# EAGLE design ratt (EAGLE 5.01)
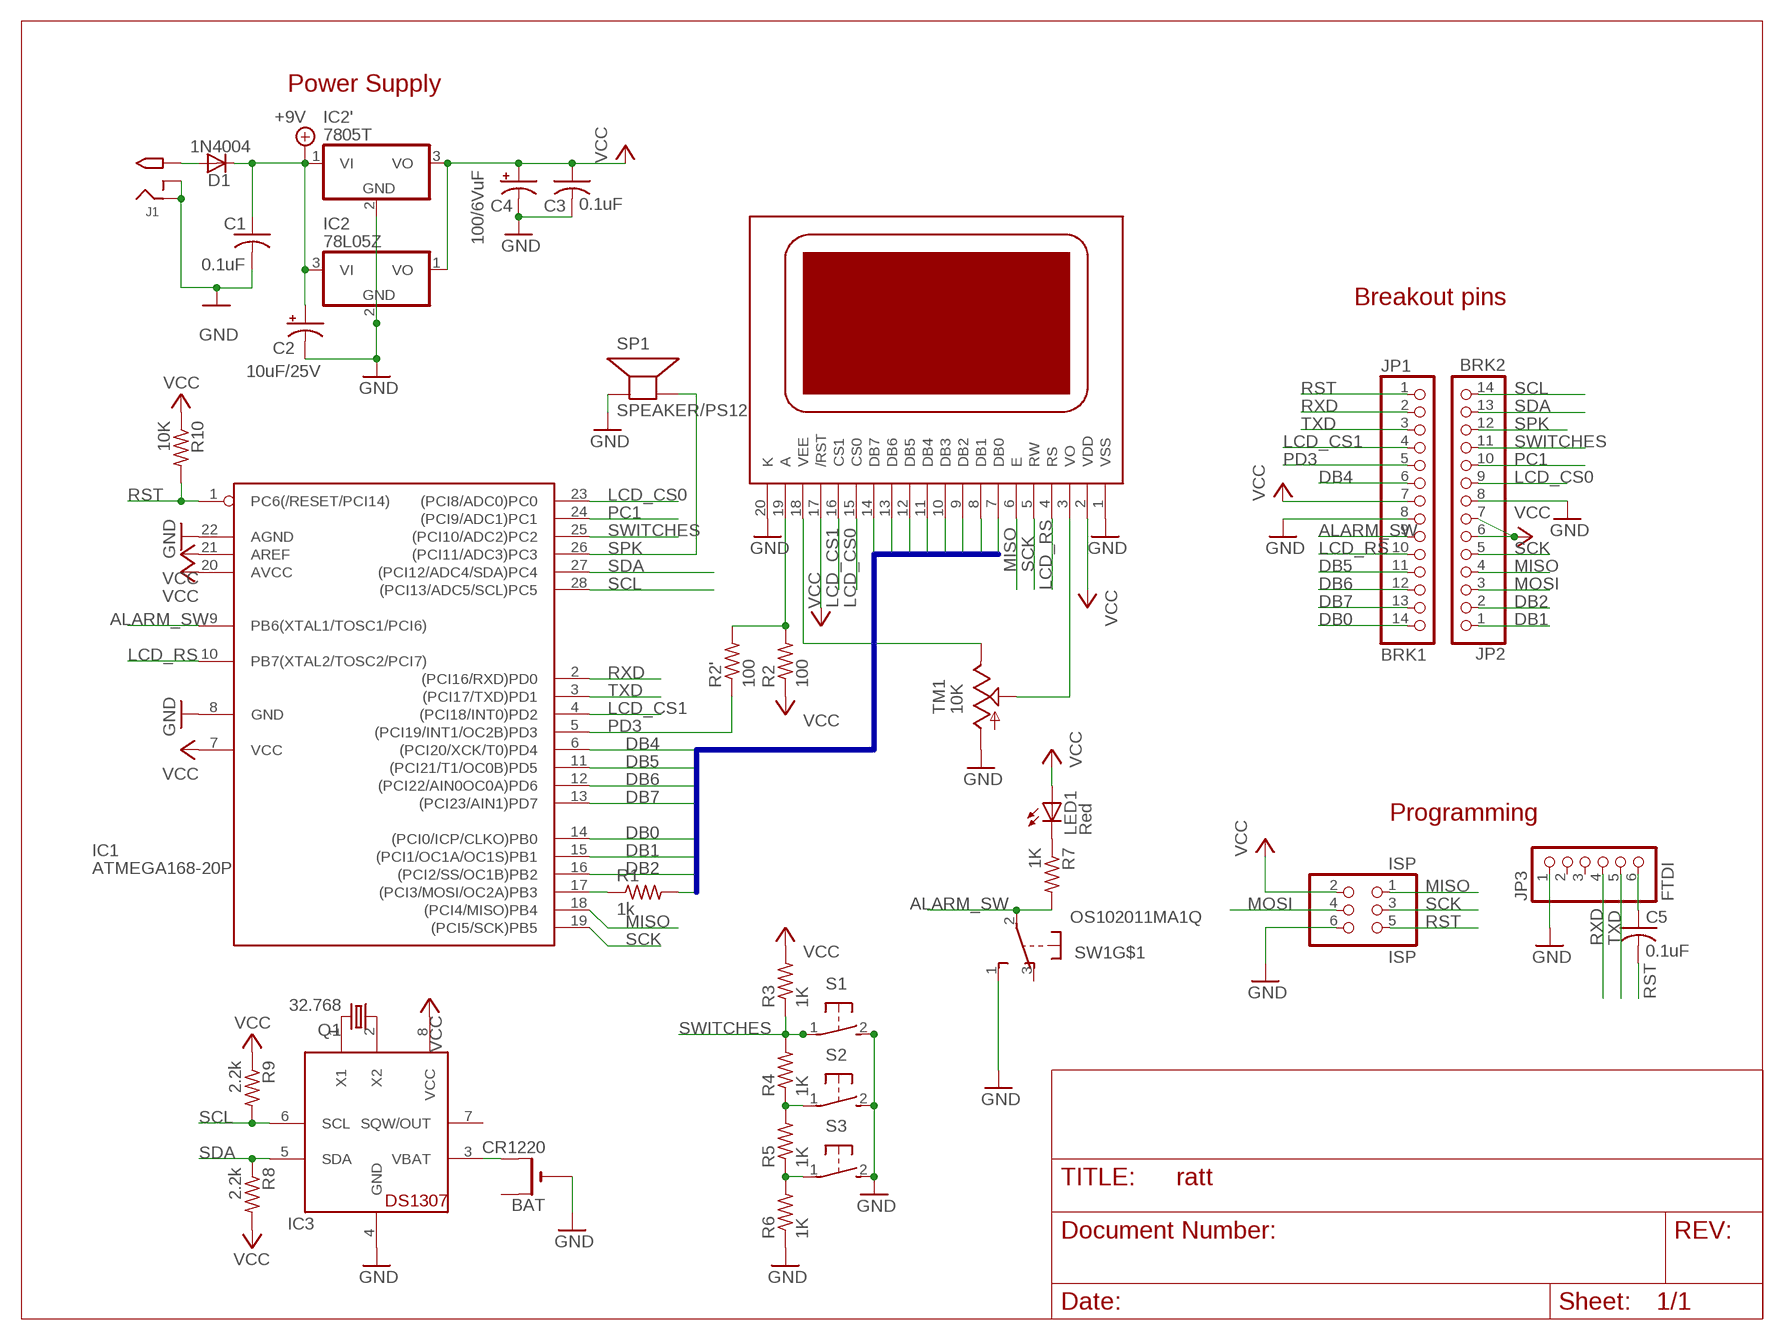
[diagram p0: schematic, sheet 1]

## Parts
BAT  CR1220  CR1220THM  [CR1220-THM]
C1  0.1uF  C-US025-025X050  [C025-025X050]
C2  10uF/25V  CPOL-USE2,5-6E  [E2,5-6E]
C3  0.1uF  C-US025-025X050  [C025-025X050]
C4  100/6VuF  CPOL-USE2,5-6E  [E2,5-6E]
C5  0.1uF  C-US025-025X050  [C025-025X050]
D1  1N4004  [DO41-10]
IC1  ATMEGA168-20P  [DIL28-3]
IC2  78L05Z  [TO92]
IC2'  7805T  [TO220H]
IC3  DS1307  [DIL08]
ISP  ISP  PINHD-2X3  [2X03]
J1  2.1MMJACK  [PJ-102A]
JP1  BRK1  PINHD-1X14  [1X14]
JP2  BRK2  PINHD-1X14  [1X14]
JP3  FTDI  PINHD-1X6  [1X06]
LED1  Red  LED3MM  [LED3MM]
Q1  32.768  CRYTALTC38H  [TC38H]
R1  1k  R-US_0207/10  [0207/10]
R2  100  R-US_0207/10  [0207/10]
R2'  100  R-US_0207/10  [0207/10]
R3  1K  R-US_0207/10  [0207/10]
R4  1K  R-US_0207/10  [0207/10]
R5  1K  R-US_0207/10  [0207/10]
R6  1K  R-US_0207/10  [0207/10]
R7  1K  R-US_0207/10  [0207/10]
R8  2.2k  R-US_0207/10  [0207/10]
R9  2.2k  R-US_0207/10  [0207/10]
R10  10K  R-US_0207/10  [0207/10]
S1  31-XX  [B3F-31XX]
S2  31-XX  [B3F-31XX]
S3  31-XX  [B3F-31XX]
SP1  SPEAKER/PS12  [PS12]
SW1  OS102011MA1Q  [OS102011MA1Q]
TM1  10K  TRIM_US-CA6H  [CA6H]
U$1  TS12864A  [TS12864]

## Nets
+9V: C1.1 C2.+ D1.C IC2'.1(VI) IC2.3(VI)
A: R2'.2 R2.2 U$1.19(A)
ALARM_SW: IC1.9(PB6(XTAL1/TOSC1/PCI6)) JP1.9 R7.2 SW1.2(P)
DB0: IC1.14((PCI0/ICP/CLKO)PB0) JP1.14 U$1.7(DB0)
DB1: IC1.15((PCI1/OC1A/OC1S)PB1) JP2.1 U$1.8(DB1)
DB2: IC1.16((PCI2/SS/OC1B)PB2) JP2.2 U$1.9(DB2)
DB3: R1.2 U$1.10(DB3)
DB4: IC1.6((PCI20/XCK/T0)PD4) JP1.6 U$1.11(DB4)
DB5: IC1.11((PCI21/T1/OC0B)PD5) JP1.11 U$1.12(DB5)
DB6: IC1.12((PCI22/AIN0OC0A)PD6) JP1.12 U$1.13(DB6)
DB7: IC1.13((PCI23/AIN1)PD7) JP1.13 U$1.14(DB7)
GND: BAT.- C1.2 C2.- C3.2 C4.- IC1.8(GND) IC1.22(AGND) IC2'.2(GND) IC2.2(GND) IC3.4(GND) ISP.6 J1.RING J1.RING_SW JP1.8 JP2.8 JP3.1 R6.1 S1.2(S) S2.2(S) S3.2(S) SP1.P$1(+) SW1.1(S) TM1.A U$1.1(VSS) U$1.20(K)
LCD_CS0: IC1.23((PCI8/ADC0)PC0) JP2.9 U$1.15(CS0)
LCD_CS1: IC1.4((PCI18/INT0)PD2) JP1.4 U$1.16(CS1)
LCD_RS: IC1.10(PB7(XTAL2/TOSC2/PCI7)) JP1.10 U$1.4(RS)
MISO: IC1.18((PCI4/MISO)PB4) ISP.1 JP2.4 U$1.6(E)
MOSI: IC1.17((PCI3/MOSI/OC2A)PB3) ISP.4 JP2.3 R1.1
N$3: R4.1 R5.2 S2.1(P)
N$4: TM1.S U$1.3(VO)
N$14: IC3.1(X1) Q1.2
N$15: IC3.2(X2) Q1.1
N$17: D1.A J1.TIP
N$39: BAT.+2(+1) IC3.3(VBAT)
N$51: C5.1 JP3.6
N$148: LED1.K(C) R7.1
N$149: R5.1 R6.2 S3.1(P)
PC1: IC1.24((PCI9/ADC1)PC1) JP2.10
PD3: IC1.5((PCI19/INT1/OC2B)PD3) JP1.5 R2'.1
RST: C5.2 IC1.1(PC6(/RESET/PCI14)) ISP.5 JP1.1 R10.2
RXD: IC1.2((PCI16/RXD)PD0) JP1.2 JP3.4
SCK: IC1.19((PCI5/SCK)PB5) ISP.3 JP2.5 U$1.5(RW)
SCL: IC1.28((PCI13/ADC5/SCL)PC5) IC3.6(SCL) JP2.14 R9.2
SDA: IC1.27((PCI12/ADC4/SDA)PC4) IC3.5(SDA) JP2.13 R8.1
SPK: IC1.26((PCI11/ADC3)PC3) JP2.12 SP1.P$2(-)
SWITCHES: IC1.25((PCI10/ADC2)PC2) JP2.11 R3.1 R4.2 S1.1(P)
TXD: IC1.3((PCI17/TXD)PD1) JP1.3 JP3.5
VCC: C3.1 C4.+ IC1.7(VCC) IC1.20(AVCC) IC1.21(AREF) IC2'.3(VO) IC2.1(VO) IC3.8(VCC) ISP.2 JP1.7 JP2.6 JP2.7 LED1.A R2.1 R3.2 R8.2 R9.1 R10.1 U$1.2(VDD) U$1.17(/RST)
VEE: TM1.E U$1.18(VEE)
Unconnected: BAT.+1(+) IC3.7(SQW/OUT) JP3.2 JP3.3 SW1.3(O) SW1.MT1(MT) SW1.MT2(MT)

## Buses
DB[0..7]

## Notes on the sheet
- Power Supply
- Breakout pins
- Programming

## Library data of the parts
BAT = adafruit:CR1220: CR1216/CR1220/CR1225 12mm 3V lithium coin cell Great for battery packup. Both SMT and THM holders. Note the THM package has the ground pads on both sides of the PCB so that the masks are the same - this reduces the cost
C1 C3 C5 = adafruit:C-US: CAPACITOR, American symbol
C2 C4 = adafruit:CPOL-US: POLARIZED CAPACITOR, American symbol
D1 = adafruit:1N4004: DIODE General purpose 1N400x type rectifier (With bigger pads) http://www.ladyada.net/library/pcb/eaglelibrary.html
IC1 = avr:ATMEGA168*P: MICROCONTROLLER 16 kBytes FLASH 1 kBytes SRAM 512 Bytes EEPROM USART 8-channel 10 bit ADC
IC2 = linear-ez:78*: Positive VOLTAGE REGULATOR Source: http://cache.national.com/ds/LM/LM78L05.pdf http://www.fairchildsemi.com/ds/LM/LM7805.pdf
IC2' = linear:78*: Positive VOLTAGE REGULATOR Source: http://cache.national.com/ds/LM/LM78L05.pdf http://www.fairchildsemi.com/ds/LM/LM7805.pdf
IC3 = adafruit:DS1307: DS1307 Real time clock (RTC) with battery backup ability. Talk to it via i2c
ISP = pinhead-ez:PINHD-2X3: PIN HEADER
J1 = adafruit:2.1MMJACK: 2.1mm x 5.5mm DC jack with internal switch. Digikey part #PJ-102A, 4UCON part #05537 By microbuilder.eu
JP1 JP2 = pinhead:PINHD-1X14: PIN HEADER
JP3 = pinhead:PINHD-1X6: PIN HEADER
LED1 = adafruit:LED: LED OSRAM: - CHIPLED LG R971, LG N971, LY N971, LG Q971, LY Q971, LO R971, LY R971 LH N974, LH R974 LS Q976, LO Q976, LY Q976 LO Q996 - Hyper CHIPLED LW Q18S LB Q993, LB Q99A, LB R99A - SideLED LS A670, LO A670, LY A670, LG A670, LP A670 LB A673, LV A673, LT A673, LW A673 LH A674 LY A675 LS A676, LA A676, LO A676, LY A676, LW A676 LS A679, LY A679, LG A679 - Hyper Micro SIDELED® LS Y876, LA Y876, LO Y876, LY Y876 LT Y87S - SmartLED LW L88C, LW L88S LB L89C, LB L89S, LG L890 LS L89K, LO L89K, LY L89K LS L896, LA L896, LO L896, LY L896 - TOPLED LS T670, LO T670, LY T670, LG T670, LP T670 LSG T670, LSP T670, LSY T670, LOP T670, LYG T670 LG T671, LOG T671, LSG T671 LB T673, LV T673, LT T673, LW T673 LH T674 LS T676, LA T676, LO T676, LY T676, LB T676, LH T676, LSB T676, LW T676 LB T67C, LV T67C, LT T67C, LS T67K, LO T67K, LY T67K, LW E67C LS E67B, LA E67B, LO E67B, LY E67B, LB E67C, LV E67C, LT E67C LW T67C LS T679, LY T679, LG T679 LS T770, LO T770, LY T770, LG T770, LP T770 LB T773, LV T773, LT T773, LW T773 LH T774 LS E675, LA E675, LY E675, LS T675 LS T776, LA T776, LO T776, LY T776, LB T776 LHGB T686 LT T68C, LB T68C - Hyper Mini TOPLED® LB M676 - Mini TOPLED Santana® LG M470 LS M47K, LO M47K, LY M47K Source: http://www.osram.convergy.de/
Q1 = crystal:CRYTAL: CRYSTAL
R1 R2 R2' R3-R10 = adafruit:R-US_: RESISTOR, American symbol
S1-S3 = adafruit:31-XX: OMRON SWITCH Now with beefier pads!
SP1 = adafruit:SPEAKER: SPEAKER Source: Buerklin Added PS12 (for part # PS1240 piezo) http://www.ladyada.net/library/pcb/eaglelibrary.html
SW1 = adafruit:OS102011MA1Q: OS10201MA1Q through-hole right angle switch http://www.ladyada.net/library/eagle
TM1 = pot:TRIM_US-: POTENTIOMETER
U$1 = adafruit:TS12864A: KS0108 based display. Some have slightly different pinouts so double check!

## Board
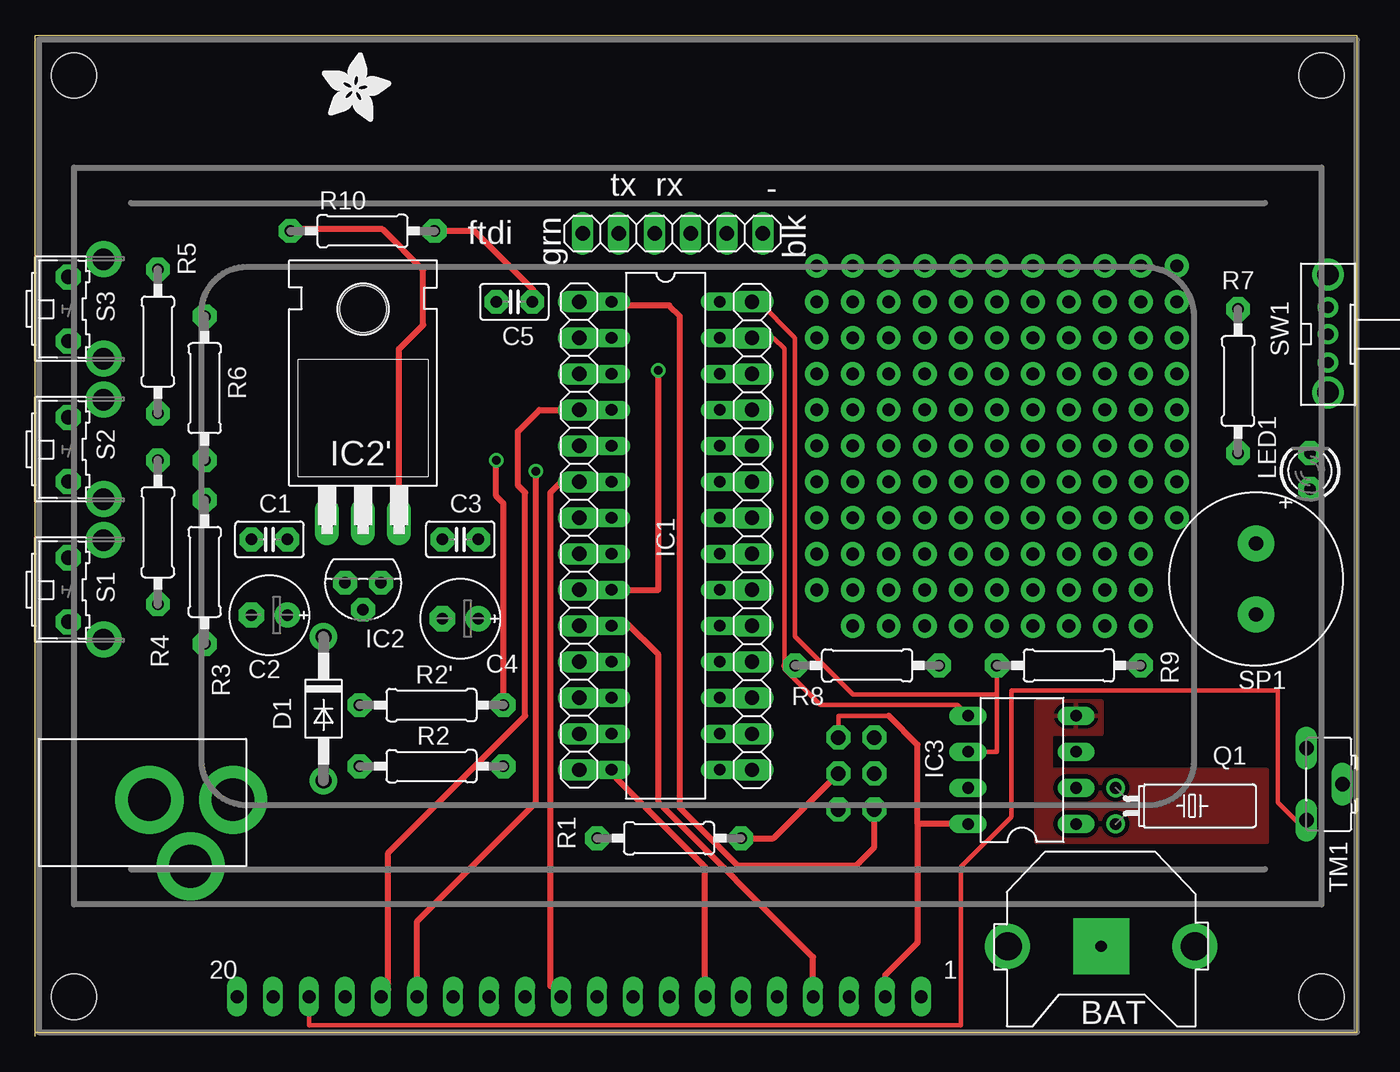
[diagram p1: board, top side]
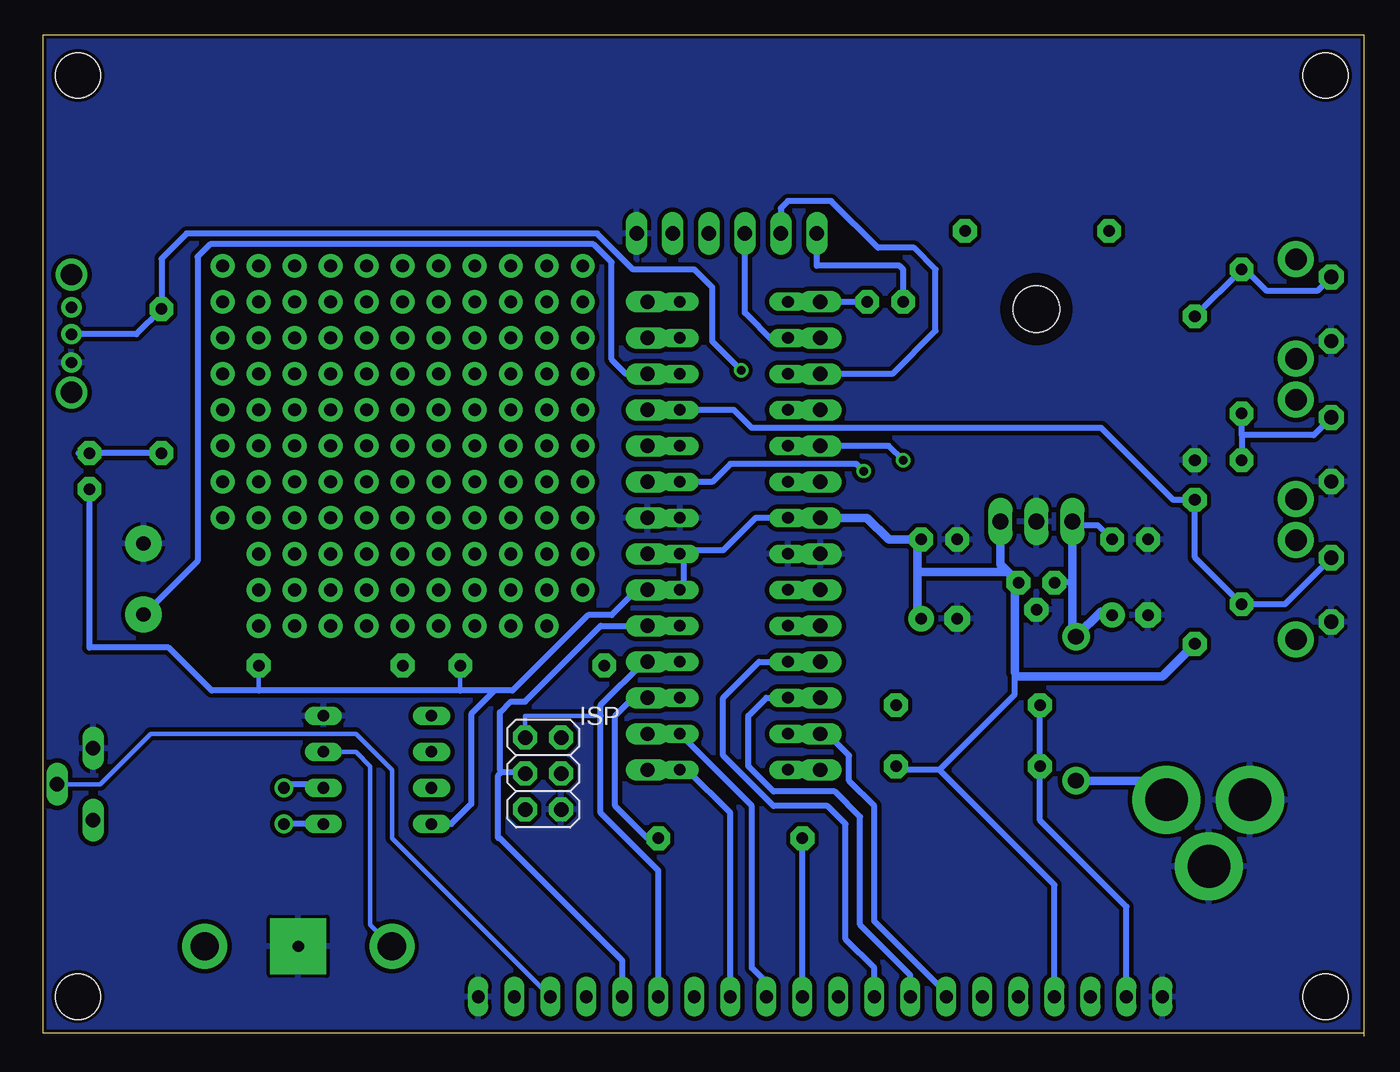
[diagram p2: board, bottom side, seen from below]

Size 93.22 x 70.61 mm. Coordinates in mm from the lower left corner, seen from the top.
Outline: 0,0 0,0.25
Outline: 0,0.25 0,70.61 93.22,70.61 93.22,0.25 0,0.25
Copper layers (1*16): Top 0.035mm / dielectric 1.5mm / Bottom 0.035mm
Design rules "default *": minimum track width 10mil, minimum drill 20mil, track to track 12mil, track to pad 12mil, pad to pad 12mil, via to via 12mil, smd to smd 0mil, copper to edge 10mil, drill to drill 8mil, minimum pad ring 10mil, minimum via ring 8mil, stop-mask expansion 4mil, vias tented up to drill 20mil, thermal gap 10mil

### Footprints (pad centres in the part's own frame; a part is rotated, then mirrored left to right if it is on the bottom)
CR1220-THM = drill 2 pad 3.175 round: +1 -6.604,0; +2 6.604,0 | drill 0.8 pad 3.962 square: - 0,0
C025-025X050 = drill 0.813 pad 1.676 octagon: 1 -1.27,0; 2 1.27,0
E2,5-6E = drill 0.813 pad 1.778 round: + -1.27,0 | drill 0.813 pad 1.778 octagon: - 1.27,0
DO41-10 = drill 1.118 pad 1.93 round: A 5.08,0; C -5.08,0
DIL28-3 = drill 0.813 long: 1 -16.51,-3.81; 2 -13.97,-3.81; 3 -11.43,-3.81; 4 -8.89,-3.81; 5 -6.35,-3.81; 6 -3.81,-3.81; 7 -1.27,-3.81; 8 1.27,-3.81; 9 3.81,-3.81; 10 6.35,-3.81; 11 8.89,-3.81; 12 11.43,-3.81; 13 13.97,-3.81; 14 16.51,-3.81; 15 16.51,3.81; 16 13.97,3.81; 17 11.43,3.81; 18 8.89,3.81; 19 6.35,3.81; 20 3.81,3.81; 21 1.27,3.81; 22 -1.27,3.81; 23 -3.81,3.81; 24 -6.35,3.81; 25 -8.89,3.81; 26 -11.43,3.81; 27 -13.97,3.81; 28 -16.51,3.81
TO92 = drill 0.813 pad 1.676 octagon: 1 -1.27,0; 2 0,1.905; 3 1.27,0
TO220H = drill 1.118 long: 1 -2.54,-10.16; 2 0,-10.16; 3 2.54,-10.16 | hole 3.302: 0,4.826
DIL08 = drill 0.813 long: 1 -3.81,-3.81; 2 -1.27,-3.81; 3 1.27,-3.81; 4 3.81,-3.81; 5 3.81,3.81; 6 1.27,3.81; 7 -1.27,3.81; 8 -3.81,3.81
2X03 = drill 1.016 pad 1.676 octagon: 1 -2.54,-1.27; 2 -2.54,1.27; 3 0,-1.27; 4 0,1.27; 5 2.54,-1.27; 6 2.54,1.27
PJ-102A = drill 3 pad 4.8 round: RING 0.1,-3.39; RING_SW -4.6,-6.29; TIP 0.1,-9.29
1X14 = drill 1.016 long: 1 -16.51,0; 2 -13.97,0; 3 -11.43,0; 4 -8.89,0; 5 -6.35,0; 6 -3.81,0; 7 -1.27,0; 8 1.27,0; 9 3.81,0; 10 6.35,0; 11 8.89,0; 12 11.43,0; 13 13.97,0; 14 16.51,0
1X06 = drill 1.016 long: 1 -6.35,0; 2 -3.81,0; 3 -1.27,0; 4 1.27,0; 5 3.81,0; 6 6.35,0
LED3MM = drill 0.813 pad 1.676 octagon: A -1.27,0; K 1.27,0
TC38H = drill 0.813 round: 1 -1.27,0; 2 1.27,0
0207/10 = drill 0.813 pad 1.676 octagon: 1 -5.08,0; 2 5.08,0
B3F-31XX = drill 1.016 pad 1.778 octagon: 1 -2.261,-1.245; 2 2.261,-1.245 | drill 1.499 pad 2.54 round: 3 -3.505,1.245; 4 3.505,1.245
PS12 = drill 1 pad 2.54 round: P$1 -2.5,0; P$2 2.5,0
OS102011MA1Q = drill 0.8 pad 1.422 round: 1 -2,0; 2 0,0; 3 1.9,0 | drill 1.5 pad 2.184 round: MT1 -4.1,0; MT2 4.2,0
CA6H = drill 1.016 long: A -2.54,0; E 2.54,0; S 0,2.54
TS12864 = drill 0.9 long: 1 48.26,0; 2 45.72,0; 3 43.18,0; 4 40.64,0; 5 38.1,0; 6 35.56,0; 7 33.02,0; 8 30.48,0; 9 27.94,0; 10 25.4,0; 11 22.86,0; 12 20.32,0; 13 17.78,0; 14 15.24,0; 15 12.7,0; 16 10.16,0; 17 7.62,0; 18 5.08,0; 19 2.54,0; 20 0,0 | hole 3.2: -11.5,65; 76.5,65; -11.5,0; 76.5,0

### Placement (x,y rotation side)
BAT  75.18,6.35 180 top
C1  16.51,35.05 180 top
C2  16.51,29.72 180 top
C3  29.97,35.05 180 top
C4  29.97,29.46 180 top
C5  33.78,51.82 0 top
D1  20.32,23.11 270 top
IC1  44.45,35.31 270 top
IC2  23.11,32 180 top
IC2'  23.11,46.48 0 top
IC3  69.6,18.8 90 top
ISP  57.91,18.54 270 bottom
J1  4.65,16.59 90 top
JP1  38.35,35.31 270 top
JP2  50.55,35.31 90 top
JP3  44.96,56.64 180 top
LED1  89.92,39.88 90 top
Q1  76.2,16.26 270 top
R1  44.7,13.97 180 top
R2  27.94,19.05 180 top
R2'  27.94,23.37 180 top
R3  11.94,32.77 270 top
R4  8.64,35.56 270 top
R5  8.64,49.02 270 top
R6  11.94,45.72 90 top
R7  84.84,46.23 90 top
R8  58.67,26.16 0 top
R9  72.9,26.16 180 top
R10  23.07,56.81 0 top
S1  3.56,31.5 270 top
S2  3.56,41.4 270 top
S3  3.56,51.31 270 top
SP1  86.11,32.26 270 top
SW1  91.19,49.53 90 top
TM1  89.66,17.78 270 top
U$1  14.22,2.79 0 top
U$2  [ADAFRUIT_5MM]  20.21,64.54 0 top

### Tracks (layer width: path | path; a pad name or v marks a point on that pad's centre or on a via)
+9V
  Bottom 0.406: 20.57,32 IC2.3 | IC2'.1 20.32,36.07 18.8,36.07 C1.1
  Bottom 0.61: 20.57,36.58 IC2'.1 20.57,32 20.57,28.45 D1.C 18.54,29.97 18.03,29.97 C2.+
A
  Bottom 0.406: U$1.19 16.76,9.14 22.86,15.24 R2.2 R2'.2
ALARM_SW  (via drill 0.6)
  Top 0.406: IC1.9 43.94,31.5 v43.94,46.99
  Bottom 0.406: SW1.2 86.61,49.53 R7.2 84.84,54.86 83.06,56.64 54.1,56.64 51.56,54.1 47.24,54.1 45.97,52.83 45.97,49.02 v43.94,46.99 | JP1.9 IC1.9
DB0
  Top 0.406: IC1.14 40.64,18.54 47.24,11.94 U$1.7
  Bottom 0.406: IC1.14 JP1.14
DB1
  Bottom 0.406: JP2.1 IC1.15 47.75,18.8 44.7,15.75 U$1.8
DB2
  Bottom 0.406: IC1.16 47.75,21.34 | IC1.16 JP2.2 | U$1.9 42.16,3.81 43.18,4.83 43.18,16.26 IC1.16
DB3
  Bottom 0.406: U$1.10 R1.2
DB4
  Top 0.406: U$1.11 36.32,3.56 36.32,38.35 37.08,39.12 JP1.6 38.61,39.12 38.86,39.12
  Bottom 0.406: JP1.6 IC1.6
DB5
  Bottom 0.406: IC1.11 JP1.11 42.67,26.42 45.21,23.88 45.21,19.81 41.66,16.26 37.85,16.26 36.58,14.99 36.58,6.86 34.54,4.83 U$1.12
DB6
  Bottom 0.406: JP1.12 IC1.12 42.16,23.88 43.43,22.61 43.43,19.05 41.66,17.27 37.34,17.27 35.56,15.49 35.56,7.87 32,4.32 U$1.13
DB7
  Bottom 0.406: IC1.13 JP1.13 37.85,21.34 36.32,19.81 36.32,18.03 34.54,16.26 34.54,8.13 29.46,3.05 U$1.14
GND
  Bottom 0.406: JP2.8 IC1.22 | JP1.8 IC1.8
  pour Bottom: 0,0 0,70.36 93.22,70.36 93.09,55.63 53.98,55.63 53.98,27.94 79.76,27.56 82.8,27.56 82.8,55.37 93.22,55.37 93.22,0
  pour Top: 70.61,23.37 70.61,13.72 86.87,13.72 86.87,18.8 71.63,18.8 71.63,21.34 75.18,21.34 75.18,23.62 70.61,23.62
LCD_CS0  (via drill 0.6)
  Top 0.406: U$1.15 26.92,8.13 35.31,16.51 v35.31,39.88
  Bottom 0.406: v35.31,39.88 35.81,40.39 44.7,40.39 45.97,39.12 IC1.23 JP2.9
LCD_CS1
  Top 0.406: U$1.16 24.89,3.3 24.89,12.95 34.54,22.61 34.54,38.35 34.04,38.86 34.04,42.67 35.56,44.2 JP1.4 39.12,44.2
  Bottom 0.406: JP1.4 IC1.4
LCD_RS
  Top 0.406: U$1.4 54.86,5.59 43.94,16.51 43.94,26.92 41.66,29.21 40.39,29.21 IC1.10
  Bottom 0.406: IC1.10 JP1.10
MISO
  Bottom 0.305: ISP.1 59.18,22.61 53.85,22.61
  Bottom 0.406: IC1.18 JP2.4 50.8,26.42 53.85,23.37 53.85,22.61 53.85,15.75 49.78,11.68 U$1.6
MOSI
  Top 0.406: ISP.4 52.07,13.97 R1.1
  Bottom 0.406: 49.28,23.88 JP2.3 | 49.28,23.88 IC1.17 | R1.1 50.55,13.97 52.83,16.26 52.83,22.61 51.56,23.88 49.28,23.88
N$1  (via drill 0.9 pad 1.68)
  other vias: 55.12,46.74
N$2  (via drill 0.9 pad 1.68)
  other vias: 57.66,46.74
N$3
  Bottom 0.406: 8.38,43.43 8.64,43.69 R5.2 8.64,42.42 | 8.64,42.42 R4.1 | 8.64,42.42 3.56,42.42 2.54,43.43 | 2.54,43.43 S2.1 2.03,43.94 2.03,44.2 2.54,43.69 2.54,43.43
N$4
  Top 0.406: U$1.3 57.15,2.79
  Bottom 0.305: TM1.S 89.15,17.78 85.6,21.34 71.12,21.34 68.58,18.8 68.58,13.97 U$1.3
N$5  (via drill 0.9 pad 1.68)
  other vias: 60.2,46.74
N$6  (via drill 0.9 pad 1.68)
  other vias: 62.74,46.74
N$7  (via drill 0.9 pad 1.68)
  other vias: 65.28,46.74
N$8  (via drill 0.9 pad 1.68)
  other vias: 67.82,46.74
N$9  (via drill 0.9 pad 1.68)
  other vias: 70.36,46.74
N$10  (via drill 0.9 pad 1.68)
  other vias: 72.9,46.74
N$11  (via drill 0.9 pad 1.68)
  other vias: 75.44,46.74
N$12  (via drill 0.9 pad 1.68)
  other vias: 77.98,46.74
N$13  (via drill 0.9 pad 1.68)
  other vias: 80.52,46.74
N$14
  Bottom 0.406: IC3.1 Q1.2
N$15
  Bottom 0.406: Q1.1 75.95,17.78 73.91,17.78 73.66,17.53 73.66,17.27 IC3.2
N$16  (via drill 0.9 pad 1.68)
  other vias: 80.52,44.2
N$17
  Bottom 0.406: 13.71,18.03 13.63,18.03 13.63,16.69 | 13.63,16.69 13.63,16.4 | J1.TIP 13.63,16.69
  Bottom 0.61: 13.71,18.03 D1.A
N$18  (via drill 0.9 pad 1.68)
  other vias: 77.98,44.2
N$19  (via drill 0.9 pad 1.68)
  other vias: 75.44,44.2
N$20  (via drill 0.9 pad 1.68)
  other vias: 72.9,44.2
N$21  (via drill 0.9 pad 1.68)
  other vias: 70.36,44.2
N$22  (via drill 0.9 pad 1.68)
  other vias: 67.82,44.2
N$23  (via drill 0.9 pad 1.68)
  other vias: 65.28,44.2
N$24  (via drill 0.9 pad 1.68)
  other vias: 62.74,44.2
N$25  (via drill 0.9 pad 1.68)
  other vias: 60.2,44.2
N$26  (via drill 0.9 pad 1.68)
  other vias: 57.66,44.2
N$27  (via drill 0.9 pad 1.68)
  other vias: 55.12,44.2
N$28  (via drill 0.9 pad 1.68)
  other vias: 55.12,41.66
N$29  (via drill 0.9 pad 1.68)
  other vias: 57.66,41.66
N$30  (via drill 0.9 pad 1.68)
  other vias: 60.2,41.66
N$31  (via drill 0.9 pad 1.68)
  other vias: 62.74,41.66
N$32  (via drill 0.9 pad 1.68)
  other vias: 65.28,41.66
N$33  (via drill 0.9 pad 1.68)
  other vias: 67.82,41.66
N$34  (via drill 0.9 pad 1.68)
  other vias: 70.36,41.66
N$35  (via drill 0.9 pad 1.68)
  other vias: 72.9,41.66
N$36  (via drill 0.9 pad 1.68)
  other vias: 77.98,41.66
N$37  (via drill 0.9 pad 1.68)
  other vias: 75.44,41.66
N$38  (via drill 0.9 pad 1.68)
  other vias: 80.52,41.66
N$39
  Bottom 0.305: IC3.3 71.12,20.07 70.1,19.05 70.1,7.87 BAT.+2
N$40  (via drill 0.9 pad 1.68)
  other vias: 55.12,39.12
N$41  (via drill 0.9 pad 1.68)
  other vias: 57.66,39.12
N$42  (via drill 0.9 pad 1.68)
  other vias: 60.2,39.12
N$43  (via drill 0.9 pad 1.68)
  other vias: 62.74,39.12
N$44  (via drill 0.9 pad 1.68)
  other vias: 65.28,39.12
N$45  (via drill 0.9 pad 1.68)
  other vias: 67.82,39.12
N$46  (via drill 0.9 pad 1.68)
  other vias: 70.36,39.12
N$47  (via drill 0.9 pad 1.68)
  other vias: 72.9,39.12
N$48  (via drill 0.9 pad 1.68)
  other vias: 75.44,39.12
N$49  (via drill 0.9 pad 1.68)
  other vias: 77.98,39.12
N$50  (via drill 0.9 pad 1.68)
  other vias: 80.52,39.12
N$51
  Bottom 0.406: JP3.6 38.61,54.36 32.77,54.36 32.51,54.1 C5.1
N$53  (via drill 0.9 pad 1.68)
  other vias: 80.52,36.58
N$54  (via drill 0.9 pad 1.68)
  other vias: 77.98,36.58
N$55  (via drill 0.9 pad 1.68)
  other vias: 75.44,36.58
N$56  (via drill 0.9 pad 1.68)
  other vias: 72.9,36.58
N$57  (via drill 0.9 pad 1.68)
  other vias: 70.36,36.58
N$58  (via drill 0.9 pad 1.68)
  other vias: 67.82,36.58
N$59  (via drill 0.9 pad 1.68)
  other vias: 65.28,36.58
N$60  (via drill 0.9 pad 1.68)
  other vias: 62.74,36.58
N$61  (via drill 0.9 pad 1.68)
  other vias: 60.2,36.58
N$62  (via drill 0.9 pad 1.68)
  other vias: 57.66,36.58
N$63  (via drill 0.9 pad 1.68)
  other vias: 55.12,36.58
N$64  (via drill 0.9 pad 1.68)
  other vias: 55.12,34.04
N$65  (via drill 0.9 pad 1.68)
  other vias: 57.66,34.04
N$66  (via drill 0.9 pad 1.68)
  other vias: 60.2,34.04
N$67  (via drill 0.9 pad 1.68)
  other vias: 62.74,34.04
N$68  (via drill 0.9 pad 1.68)
  other vias: 65.28,34.04
N$69  (via drill 0.9 pad 1.68)
  other vias: 67.82,34.04
N$70  (via drill 0.9 pad 1.68)
  other vias: 70.36,34.04
N$71  (via drill 0.9 pad 1.68)
  other vias: 72.9,34.04
N$72  (via drill 0.9 pad 1.68)
  other vias: 77.98,34.04
N$73  (via drill 0.9 pad 1.68)
  other vias: 75.44,34.04
N$76  (via drill 0.9 pad 1.68)
  other vias: 55.12,31.5
N$77  (via drill 0.9 pad 1.68)
  other vias: 57.66,31.5
N$78  (via drill 0.9 pad 1.68)
  other vias: 60.2,31.5
N$79  (via drill 0.9 pad 1.68)
  other vias: 62.74,31.5
N$80  (via drill 0.9 pad 1.68)
  other vias: 65.28,31.5
N$81  (via drill 0.9 pad 1.68)
  other vias: 67.82,31.5
N$82  (via drill 0.9 pad 1.68)
  other vias: 70.36,31.5
N$83  (via drill 0.9 pad 1.68)
  other vias: 72.9,31.5
N$84  (via drill 0.9 pad 1.68)
  other vias: 75.44,31.5
N$85  (via drill 0.9 pad 1.68)
  other vias: 77.98,31.5
N$90  (via drill 0.9 pad 1.68)
  other vias: 77.98,28.96
N$91  (via drill 0.9 pad 1.68)
  other vias: 75.44,28.96
N$92  (via drill 0.9 pad 1.68)
  other vias: 72.9,28.96
N$93  (via drill 0.9 pad 1.68)
  other vias: 70.36,28.96
N$94  (via drill 0.9 pad 1.68)
  other vias: 67.82,28.96
N$95  (via drill 0.9 pad 1.68)
  other vias: 65.28,28.96
N$96  (via drill 0.9 pad 1.68)
  other vias: 62.74,28.96
N$97  (via drill 0.9 pad 1.68)
  other vias: 60.2,28.96
N$98  (via drill 0.9 pad 1.68)
  other vias: 57.66,28.96
N$112  (via drill 0.9 pad 1.68)
  other vias: 55.12,54.36
N$113  (via drill 0.9 pad 1.68)
  other vias: 57.66,54.36
N$114  (via drill 0.9 pad 1.68)
  other vias: 60.2,54.36
N$115  (via drill 0.9 pad 1.68)
  other vias: 62.74,54.36
N$116  (via drill 0.9 pad 1.68)
  other vias: 65.28,54.36
N$117  (via drill 0.9 pad 1.68)
  other vias: 67.82,54.36
N$118  (via drill 0.9 pad 1.68)
  other vias: 70.36,54.36
N$119  (via drill 0.9 pad 1.68)
  other vias: 72.9,54.36
N$120  (via drill 0.9 pad 1.68)
  other vias: 75.44,54.36
N$121  (via drill 0.9 pad 1.68)
  other vias: 77.98,54.36
N$122  (via drill 0.9 pad 1.68)
  other vias: 80.52,54.36
N$125  (via drill 0.9 pad 1.68)
  other vias: 80.52,51.82
N$126  (via drill 0.9 pad 1.68)
  other vias: 77.98,51.82
N$127  (via drill 0.9 pad 1.68)
  other vias: 75.44,51.82
N$128  (via drill 0.9 pad 1.68)
  other vias: 72.9,51.82
N$129  (via drill 0.9 pad 1.68)
  other vias: 70.36,51.82
N$130  (via drill 0.9 pad 1.68)
  other vias: 67.82,51.82
N$131  (via drill 0.9 pad 1.68)
  other vias: 65.28,51.82
N$132  (via drill 0.9 pad 1.68)
  other vias: 62.74,51.82
N$133  (via drill 0.9 pad 1.68)
  other vias: 60.2,51.82
N$134  (via drill 0.9 pad 1.68)
  other vias: 57.66,51.82
N$135  (via drill 0.9 pad 1.68)
  other vias: 55.12,51.82
N$136  (via drill 0.9 pad 1.68)
  other vias: 55.12,49.28
N$137  (via drill 0.9 pad 1.68)
  other vias: 57.66,49.28
N$138  (via drill 0.9 pad 1.68)
  other vias: 60.2,49.28
N$139  (via drill 0.9 pad 1.68)
  other vias: 62.74,49.28
N$140  (via drill 0.9 pad 1.68)
  other vias: 65.28,49.28
N$141  (via drill 0.9 pad 1.68)
  other vias: 67.82,49.28
N$142  (via drill 0.9 pad 1.68)
  other vias: 70.36,49.28
N$143  (via drill 0.9 pad 1.68)
  other vias: 72.9,49.28
N$144  (via drill 0.9 pad 1.68)
  other vias: 77.98,49.28
N$145  (via drill 0.9 pad 1.68)
  other vias: 75.44,49.28
N$146  (via drill 0.9 pad 1.68)
  other vias: 80.52,49.28
N$148
  Bottom 0.406: 90.68,41.15 LED1.K R7.1
N$149
  Bottom 0.406: S3.1 3.3,52.58 6.86,52.58 8.13,53.85 8.64,53.85 R5.1 R6.2
PC1
  Bottom 0.406: JP2.10 IC1.24
PD3  (via drill 0.6)
  Top 0.406: R2'.1 33.02,37.59 32.51,38.1 v32.51,40.64
  Bottom 0.406: IC1.5 JP1.5 33.53,41.66 v32.51,40.64
RST
  Top 0.406: 40.39,51.56 IC1.1 40.64,51.56 44.7,51.56 45.47,50.8 45.47,16.13 49.53,12.06 57.91,12.06 59.18,13.34 59.18,15.75 59.31,15.88 ISP.5 | R10.2 30.96,56.81 35.11,52.67 35.11,51.74 35.05,51.68 | 35.05,51.68 35.03,51.66 | C5.2 35.05,51.68
  Bottom 0.406: IC1.1 JP1.1 C5.2
RXD
  Bottom 0.406: JP1.2 IC1.2 40.89,49.02 41.66,49.02 43.69,51.05 JP3.4
SCK
  Bottom 0.406: IC1.19 JP2.5 53.85,28.96 59.18,23.62 60.2,23.62 60.96,22.86 60.96,18.8 60.83,18.67 | U$1.5 52.32,5.33 60.96,13.97 61.09,13.97 61.09,18.41 60.83,18.67 | ISP.3 59.18,18.67 60.83,18.67
SCL
  Top 0.305: IC3.6 67.82,20.07 67.82,24.13 | JP2.14 51.05,51.82 53.59,49.28 53.59,28.19 57.66,24.13 67.82,24.13 | 67.82,24.13 R9.2
  Bottom 0.406: JP2.14 IC1.28
SDA
  Top 0.305: IC3.5 65.02,23.37 60.71,23.37 55.37,23.37 52.83,25.91 52.83,26.16 52.83,48.51 52.07,49.28 JP2.13
  Top 0.406: 52.83,26.16 R8.1
  Bottom 0.406: JP2.13 IC1.27
SPK
  Bottom 0.406: 86.07,29.76 SP1.P$2 | 86.07,29.76 82.3,33.53 82.3,54.99 81.41,55.88 54.36,55.88 53.09,54.61 53.09,47.75 52.07,46.74 JP2.12 IC1.26 47.24,46.74 | 86.07,29.76 86.11,29.72
SWITCHES
  Bottom 0.406: S1.1 5.59,30.48 R4.2 11.94,33.78 R3.1 13.46,37.85 18.54,42.93 43.18,42.93 44.45,44.2 IC1.25 JP2.11
TXD
  Bottom 0.406: IC1.3 JP1.3 33.27,46.74 30.23,49.78 30.23,54.1 31.75,55.63 34.29,55.63 37.59,58.93 40.64,58.93 41.15,58.42 JP3.5
VCC
  Top 0.305: ISP.2 56.64,22.61 60.2,22.61
  Top 0.406: 60.2,22.61 62.23,20.57 62.23,14.99 | 62.23,14.99 62.23,6.6 59.94,4.32 U$1.2 59.94,2.54 | IC3.8 62.23,14.99 | IC2'.3 25.65,48.48 27.36,50.19 27.36,54.07 24.49,56.94 18.21,56.94 17.99,56.72 | 17.99,56.72 17.98,56.7 | 17.99,56.72 R10.1
  Bottom 0.305: 63.75,24.38 R8.2 | 77.98,24.38 R9.1
  Bottom 0.406: 50.8,34.04 JP2.7 IC1.21 48.01,33.78 | 48.01,33.78 48.01,31.5 IC1.20 JP2.6 51.31,31.5 53.09,29.72 54.74,29.72 60.07,24.38 61.34,24.38 | 37.85,36.58 IC1.7 42.93,36.58 45.21,34.29 47.5,34.29 48.01,33.78 | U$1.17 21.84,10.67 29.97,18.8 | R2.1 33.27,18.8 29.97,18.8 | 29.97,18.8 24.64,24.13 24.64,25.65 24.38,25.4 | 89.91,27.43 84.33,27.43 81.28,24.38 77.98,24.38 63.75,24.38 61.34,24.38 | IC2.1 24.64,32 24.64,32.26 | 61.34,24.38 62.99,22.73 62.99,16.38 64.39,14.99 IC3.8 | LED1.A 89.91,38.68 | LED1.A | 89.91,27.43 89.92,27.43 | 89.91,27.43 LED1.A
  Bottom 0.61: JP1.7 37.85,36.58 35.05,36.58 33.53,35.05 C3.1 31.5,34.8 31.5,32.77 | R3.2 14.22,25.4 24.38,25.4 | 24.64,32.26 25.65,33.27 IC2'.3 | C4.+ 31.5,29.46 31.5,32.77 | 24.64,32.26 25.15,32.77 31.5,32.77 | 24.64,25.65 24.64,32.26
VEE
  Top 0.305: U$1.18 19.3,0.76 65.28,0.76 65.28,11.94 68.83,15.49 68.83,24.38 87.63,24.38 87.63,16.51 89.66,14.48 TM1.E

### Text on the board
tPlace: tx | rx | - | ftdi | blk | grn
tDocu: MONOCHRON | http://www.ladyada.net/make/monochron | + | + | + | v1.0